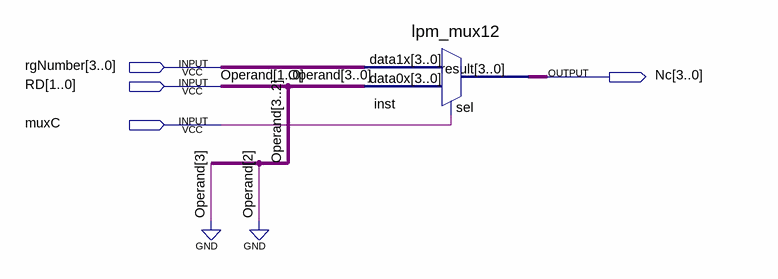
[diagram p0: schematic sheet]
// Quartus schematic muxC.bdf as structural Verilog: 1 symbols, 4 pins
module muxC (
  input  [3:0] rgNumber,
  input  [1:0] RD,
  input  muxC,
  output [3:0] Nc
);

  lpm_mux12 inst (.data1x(rgNumber), .data0x({2'b00, RD}), .sel(muxC), .result(Nc));

  // Other names for the same wires on the sheet: Operand[1:0] = RD
endmodule
